# EAGLE schematic BpodMainBoard_r0_8 (EAGLE 7.7.0)
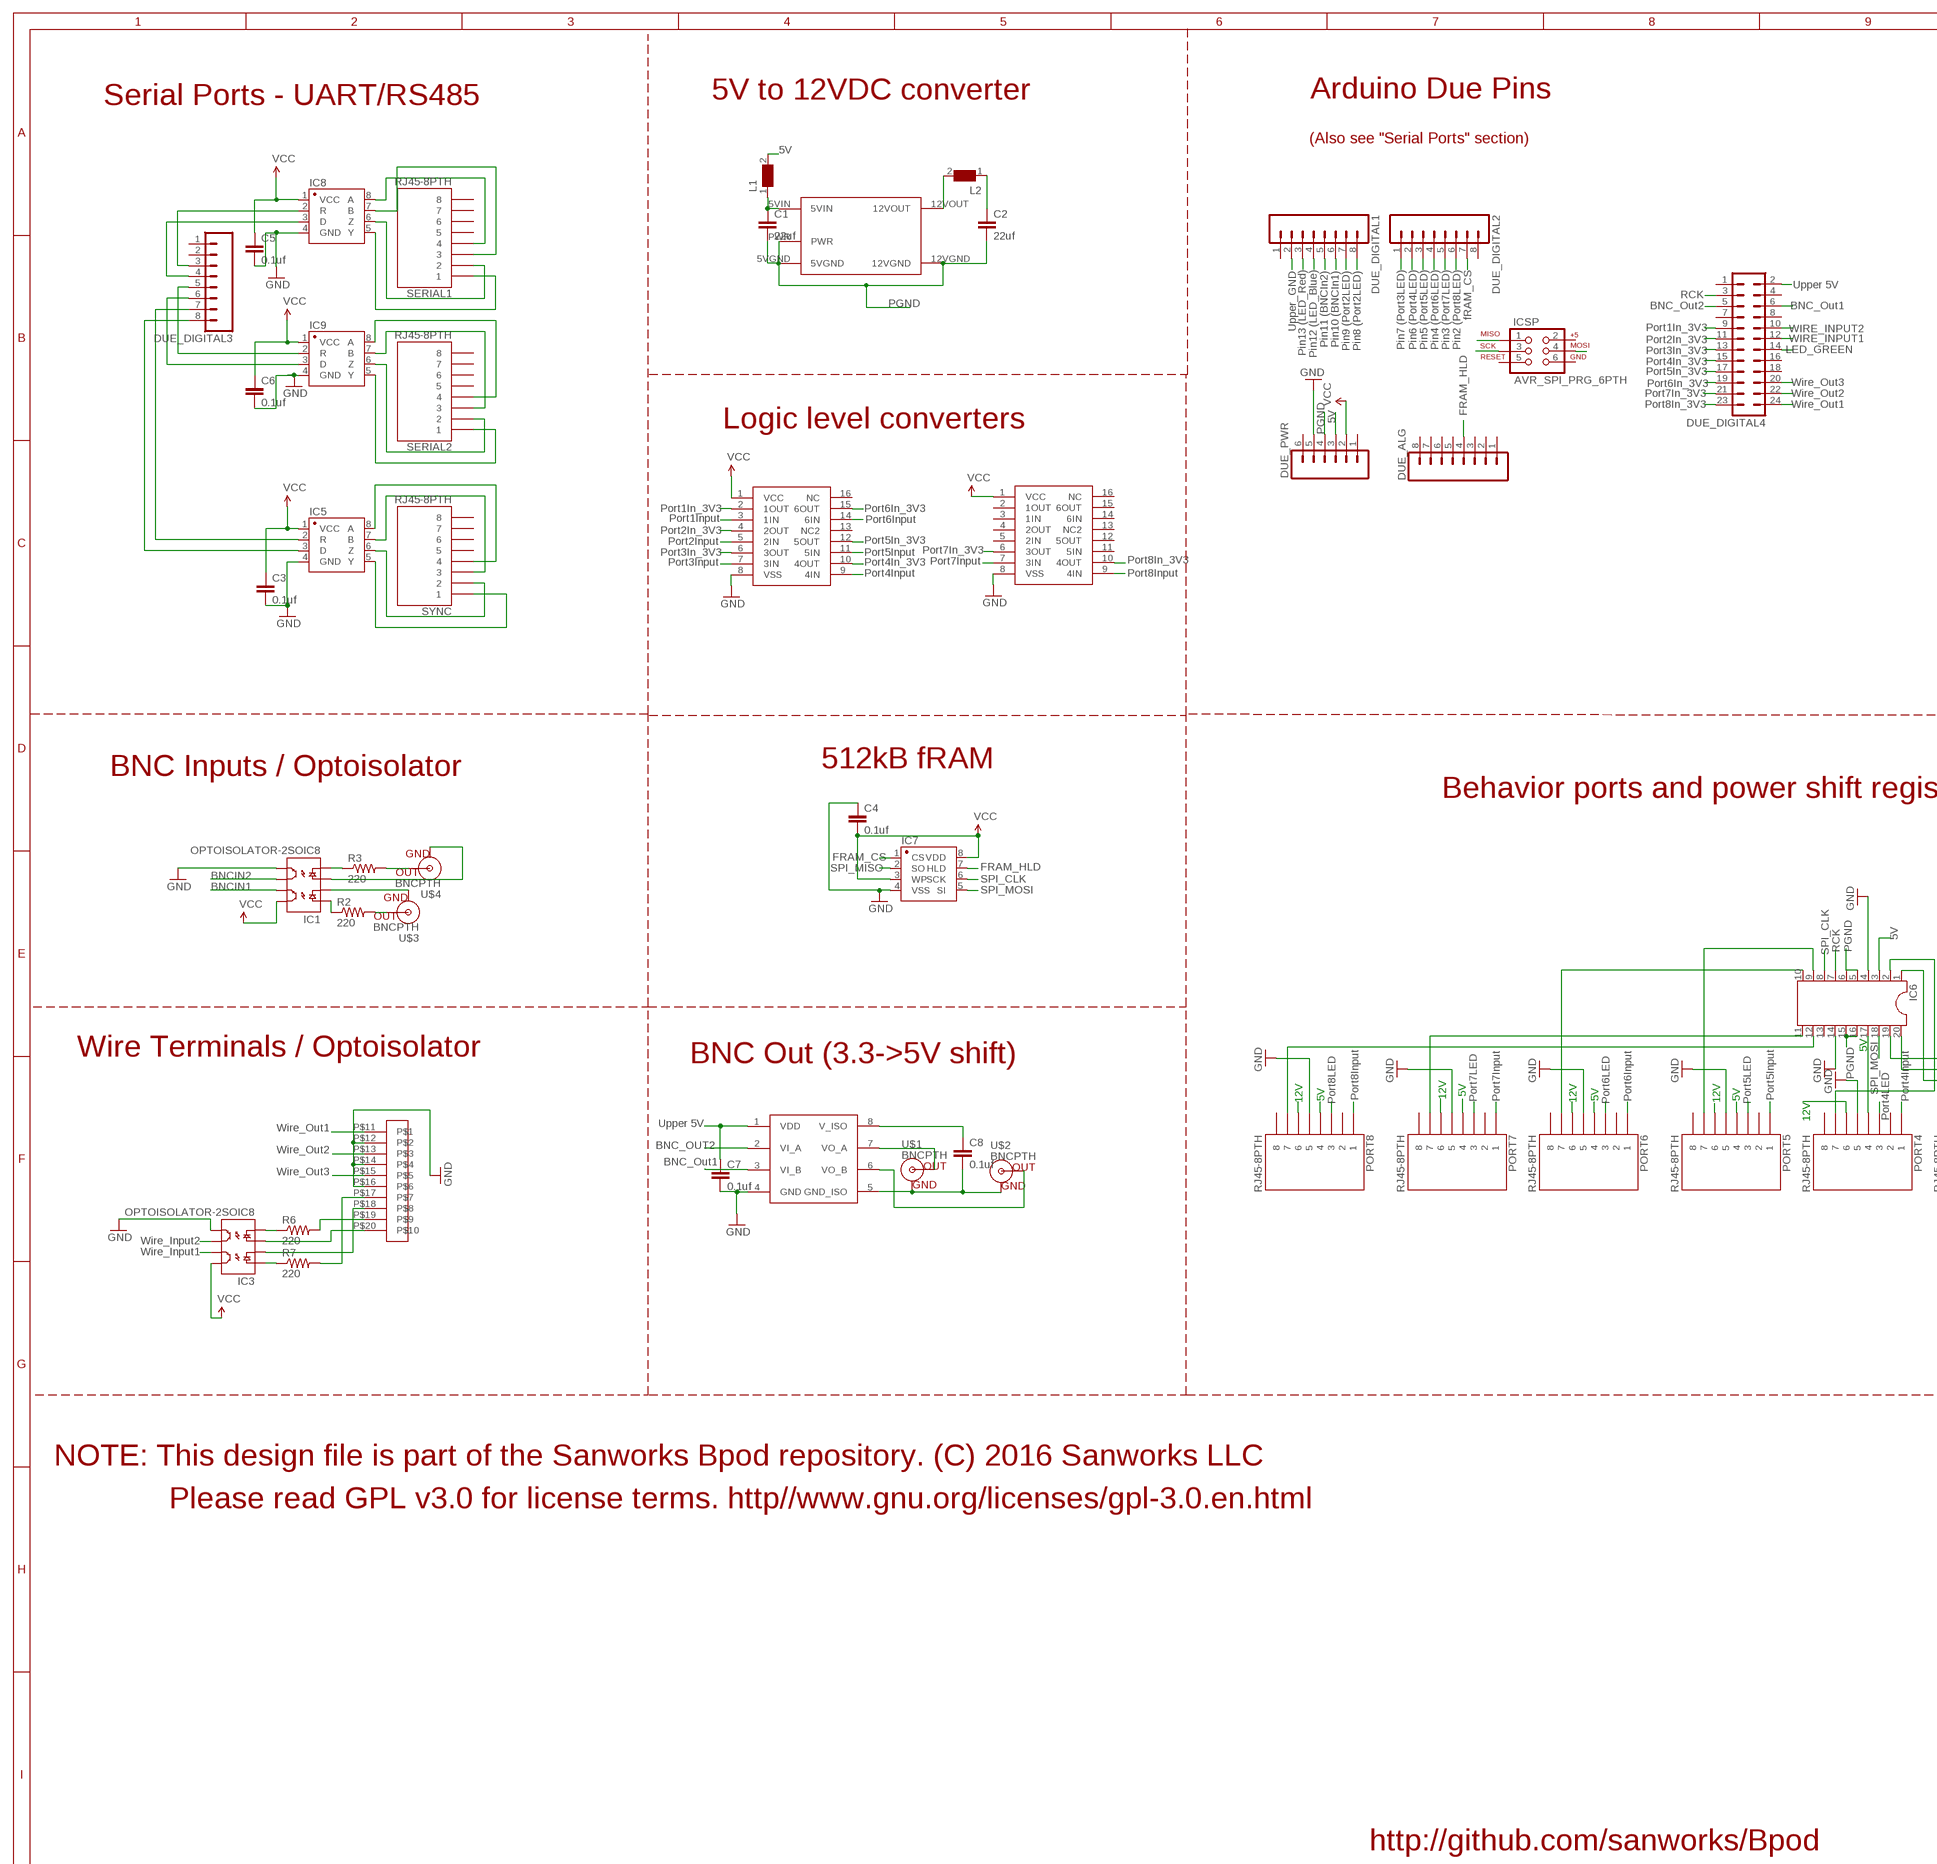
[diagram p0: schematic, sheet 1, part 1 of 2]
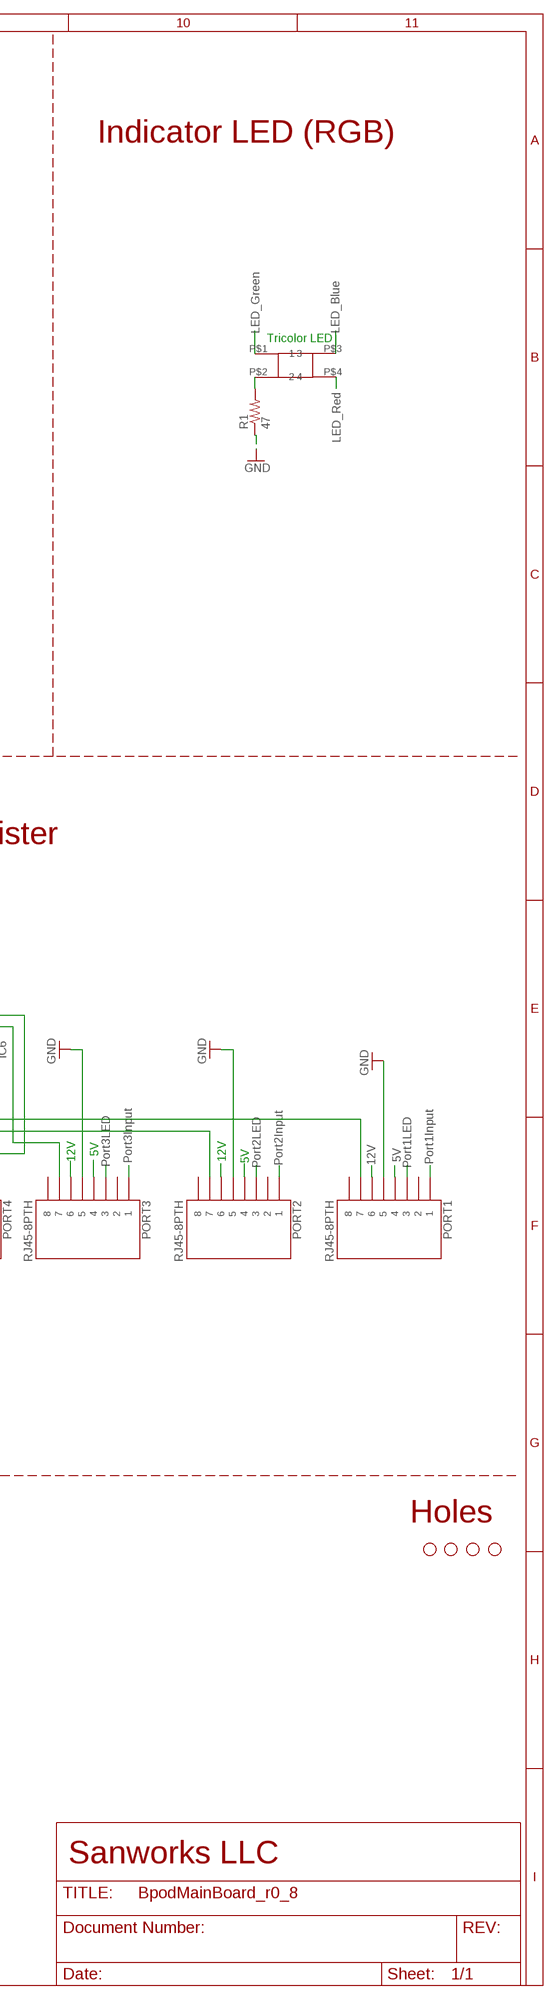
[diagram p1: schematic, sheet 1, part 2 of 2]

## Parts
C1  22uf  CAP1206  [1206]
C2  22uf  CAP1206  [1206]
C3  0.1uf  CAP1206  [1206]
C4  0.1uf  CAP1206  [1206]
C5  0.1uf  CAP1206  [1206]
C6  0.1uf  CAP1206  [1206]
C7  0.1uf  CAP1206  [1206]
C8  0.1uf  CAP1206  [1206]
DUE_ALG  M081X08  [1X08]
DUE_DIGITAL1  M081X08  [1X08]
DUE_DIGITAL2  M081X08  [1X08]
DUE_DIGITAL3  M081X08  [1X08]
DUE_DIGITAL4  MA12-2  [MA12-2]
DUE_PWR  M06SIP  [1X06]
IC1  OPTOISOLATOR-2SOIC8  [SO08-2]
IC2  CD4050  [SO16]
IC3  OPTOISOLATOR-2SOIC8  [SO08-2]
IC4  CD4050  [SO16]
IC5  SN65HVD31DR  [SO08]
IC6  DIL20  [DIL20]
IC7  CY15B104Q-SXI  [SO08-UNIVERSAL]
IC8  SN65HVD31DR  [SO08]
IC9  SN65HVD31DR  [SO08]
IC10  ADUM5240  [SO08]
ICSP  AVR_SPI_PRG_6PTH  [2X3]
JP1  STAND-OFF  [STAND-OFF]
JP2  STAND-OFF  [STAND-OFF]
JP3  STAND-OFF  [STAND-OFF]
JP4  STAND-OFF  [STAND-OFF]
L1  WE-CBF-742792118_1206  [1206]
L2  WE-CBF-742792118_1206  [1206]
PORT1  RJ45-8PTH  [RJ45-8]
PORT2  RJ45-8PTH  [RJ45-8]
PORT3  RJ45-8PTH  [RJ45-8]
PORT4  RJ45-8PTH  [RJ45-8]
PORT5  RJ45-8PTH  [RJ45-8]
PORT6  RJ45-8PTH  [RJ45-8]
PORT7  RJ45-8PTH  [RJ45-8]
PORT8  RJ45-8PTH  [RJ45-8]
R1  47  RESISTOR1206  [1206]
R2  220  RESISTOR1206  [1206]
R3  220  RESISTOR1206  [1206]
R6  220  RESISTOR1206  [1206]
R7  220  RESISTOR1206  [1206]
SERIAL1  RJ45-8PTH  [RJ45-8]
SERIAL2  RJ45-8PTH  [RJ45-8]
SYNC  RJ45-8PTH  [RJ45-8]
U$1  BNCPTH  [BNC]
U$2  BNCPTH  [BNC]
U$3  BNCPTH  [BNC]
U$4  BNCPTH  [BNC]
U$5  TDK_LAMBDA_5V_TO_12V  [TDK_LAMBDA_5V_12V]
U$6  10POS_SPRING_TERMINAL  [10POS_SCREW_TERMINAL]
U$8  SQUARE_TRICOLOR_LED  [SQUARE_TRICOLOR_LED]

## Nets
5V: DUE_PWR.3 IC6.3 IC6.17 L1.2 PORT1.4 PORT2.4 PORT3.4 PORT4.4 PORT5.4 PORT6.4 PORT7.4 PORT8.4
12V: C2.1 L2.1 PORT1.6 PORT2.6 PORT3.6 PORT4.6 PORT5.6 PORT6.6 PORT7.6 PORT8.6
BNC_OUT1: DUE_DIGITAL4.6 IC10.3(VI_B)
BNC_OUT2: DUE_DIGITAL4.5 IC10.2(VI_A)
BNCIN1: DUE_DIGITAL1.6 IC1.7(EM1)
BNCIN2: DUE_DIGITAL1.5 IC1.6(CL2)
FRAM_CS: DUE_DIGITAL2.7 IC7.1(CS)
FRAM_HLD: DUE_ALG.4 IC7.7(HLD)
GND: C3.2 C5.2 C6.2 C7.2 DUE_PWR.5 IC1.5(EM2) IC2.8(VSS) IC3.5(EM2) IC4.8(VSS) IC5.4(GND) IC6.4 IC6.14 IC7.4(VSS) IC8.4(GND) IC9.4(GND) IC10.4(GND) PORT1.5 PORT2.5 PORT3.5 PORT4.5 PORT5.5 PORT6.5 PORT7.5 PORT8.5 R1.1 U$6.P$12 U$6.P$14 U$6.P$16
ISOGND: C8.2 IC10.5(GND_ISO) U$1.GND U$2.GND
LED_BLUE: DUE_DIGITAL1.4 U$8.P$3
LED_GREEN: DUE_DIGITAL4.14 U$8.P$1
LED_RED: DUE_DIGITAL1.3 U$8.P$4
MOSI: IC6.18 IC7.5(SI) ICSP.4
N$1: R3.2 U$4.S(OUT)
N$2: R2.2 U$3.S(OUT)
N$3: IC1.3(A2) U$4.GND
N$4: IC1.2(C1) U$3.GND
N$5: R6.2 U$6.P$19
N$6: IC10.6(VO_B) U$2.S(OUT)
N$8: IC10.7(VO_A) U$1.S(OUT)
N$9: IC6.19 PORT1.7
N$10: IC6.20 PORT2.7
N$11: IC6.1 PORT3.7
N$12: IC6.2 PORT4.7
N$13: IC6.9 PORT5.7
N$14: IC6.10 PORT6.7
N$15: IC6.11 PORT7.7
N$16: IC6.12 PORT8.7
N$17: IC5.8(A) SYNC.4
N$18: IC5.7(B) SYNC.3
N$19: IC5.6(Z) SYNC.2
N$21: IC5.5(Y) SYNC.1
N$22: DUE_DIGITAL3.7 IC5.2(R)
N$23: IC3.4(C2) R6.1
N$24: IC3.1(A1) R7.1
N$25: R1.2 U$8.P$2
N$26: C8.1 IC10.8(V_ISO)
N$28: DUE_DIGITAL3.8 IC5.3(D)
N$32: IC8.8(A) SERIAL1.4
N$33: IC8.7(B) SERIAL1.3
N$34: IC8.6(Z) SERIAL1.2
N$35: IC8.5(Y) SERIAL1.1
N$36: IC9.8(A) SERIAL2.4
N$37: IC9.7(B) SERIAL2.3
N$38: IC9.6(Z) SERIAL2.2
N$40: IC9.5(Y) SERIAL2.1
N$42: DUE_DIGITAL3.3 IC8.2(R)
N$43: IC3.3(A2) U$6.P$20
N$44: R7.2 U$6.P$17
N$45: IC3.2(C1) U$6.P$18
N$46: C1.1 L1.1 U$5.5VIN
N$47: L2.2 U$5.12VOUT
N$48: DUE_DIGITAL3.4 IC8.3(D)
N$52: DUE_DIGITAL3.5 IC9.2(R)
N$53: DUE_DIGITAL3.6 IC9.3(D)
N$54: IC1.1(A1) R2.1
N$55: IC1.4(C2) R3.1
PGND: C1.2 C2.2 DUE_PWR.4 IC6.5 IC6.6 IC6.15 IC6.16 U$5.5VGND U$5.12VGND U$5.PWR
PORT1IN_3V3: DUE_DIGITAL4.9 IC4.2(1OUT)
PORT1INPUT: IC4.3(1IN) PORT1.1
PORT1LED: DUE_DIGITAL1.7 PORT1.3
PORT2IN_3V3: DUE_DIGITAL4.11 IC4.4(2OUT)
PORT2INPUT: IC4.5(2IN) PORT2.1
PORT2LED: DUE_DIGITAL1.8 PORT2.3
PORT3IN_3V3: DUE_DIGITAL4.13 IC4.6(3OUT)
PORT3INPUT: IC4.7(3IN) PORT3.1
PORT3LED: DUE_DIGITAL2.1 PORT3.3
PORT4IN_3V3: DUE_DIGITAL4.15 IC4.10(4OUT)
PORT4INPUT: IC4.9(4IN) PORT4.1
PORT4LED: DUE_DIGITAL2.2 PORT4.3
PORT5IN_3V3: DUE_DIGITAL4.17 IC4.12(5OUT)
PORT5INPUT: IC4.11(5IN) PORT5.1
PORT5LED: DUE_DIGITAL2.3 PORT5.3
PORT6IN_3V3: DUE_DIGITAL4.19 IC4.15(6OUT)
PORT6INPUT: IC4.14(6IN) PORT6.1
PORT6LED: DUE_DIGITAL2.4 PORT6.3
PORT7IN_3V3: DUE_DIGITAL4.21 IC2.6(3OUT)
PORT7INPUT: IC2.7(3IN) PORT7.1
PORT7LED: DUE_DIGITAL2.5 PORT7.3
PORT8IN_3V3: DUE_DIGITAL4.23 IC2.10(4OUT)
PORT8INPUT: IC2.9(4IN) PORT8.1
PORT8LED: DUE_DIGITAL2.6 PORT8.3
RCK: DUE_DIGITAL4.3 IC6.7
SPI_CLK: IC6.8 IC7.6(SCK) ICSP.3
SPI_MISO: IC7.2(SO) ICSP.1
UPPER_5V: C7.1 DUE_DIGITAL4.2 IC10.1(VDD)
UPPER_GND: DUE_DIGITAL1.2
VCC: C3.1 C4.2 C5.1 C6.1 DUE_PWR.2 IC1.8(CL1) IC2.1(VCC) IC3.8(CL1) IC4.1(VCC) IC5.1(VCC) IC7.3(WP) IC7.8(VDD) IC8.1(VCC) IC9.1(VCC)
WIRE_INPUT1: DUE_DIGITAL4.12 IC3.7(EM1)
WIRE_INPUT2: DUE_DIGITAL4.10 IC3.6(CL2)
WIRE_OUT1: DUE_DIGITAL4.24 U$6.P$11
WIRE_OUT2: DUE_DIGITAL4.22 U$6.P$13
WIREOUT3: DUE_DIGITAL4.20 U$6.P$15
Unconnected: C4.1 DUE_ALG.1 DUE_ALG.2 DUE_ALG.3 DUE_ALG.5 DUE_ALG.6 DUE_ALG.7 DUE_ALG.8 DUE_DIGITAL1.1 DUE_DIGITAL2.8 DUE_DIGITAL3.1 DUE_DIGITAL3.2 DUE_DIGITAL4.1 DUE_DIGITAL4.4 DUE_DIGITAL4.7 DUE_DIGITAL4.8 DUE_DIGITAL4.16 DUE_DIGITAL4.18 DUE_PWR.1 DUE_PWR.6 IC2.2(1OUT) IC2.3(1IN) IC2.4(2OUT) IC2.5(2IN) IC2.11(5IN) IC2.12(5OUT) IC2.13(NC2) IC2.14(6IN) IC2.15(6OUT) IC2.16(NC) IC4.13(NC2) IC4.16(NC) IC6.13 ICSP.2 ICSP.5 ICSP.6 PORT1.2 PORT1.8 PORT2.2 PORT2.8 PORT3.2 PORT3.8 PORT4.2 PORT4.8 PORT5.2 PORT5.8 PORT6.2 PORT6.8 PORT7.2 PORT7.8 PORT8.2 PORT8.8 SERIAL1.5 SERIAL1.6 SERIAL1.7 SERIAL1.8 SERIAL2.5 SERIAL2.6 SERIAL2.7 SERIAL2.8 SYNC.5 SYNC.6 SYNC.7 SYNC.8

## Notes on the sheet
- Serial Ports - UART/RS485 | 5V to 12VDC converter | Arduino Due Pins
- Indicator LED (RGB)
- (Also see "Serial Ports" section)
- 5V
- LED_Green
- LED_Blue
- Upper_GND | Pin13 (LED_Red) | Pin12 (LED_Blue) | Pin11 (BNCIn2) | Pin10 (BNCIn1) | Pin9 (Port2LED) | Pin8 (Port2LED) | Pin7 (Port3LED) | Pin6 (Port4LED) | Pin5 (Port5LED) | Pin4 (Port6LED) | Pin3 (Port7LED) | Pin2 (Port8LED) | fRAM_CS
- Upper 5V
- RCK
- BNC_Out2 | BNC_Out1
- PGND
- WIRE_INPUT2 | Tricolor LED
- Port1In_3V3
- WIRE_INPUT1
- Port2In_3V3 | LED_GREEN
- Port3In_3V3
- Port4In_3V3
- LED_Red
- Port5In_3V3
- Wire_Out3
- Port6In_3V3 | Wire_Out2
- Port7In_3V3
- Wire_Out1
- Port8In_3V3
- FRAM_HLD
- 5V
- Logic level converters
- PGND
- Port1In_3V3 | Port6In_3V3
- Port1Input | Port6Input
- Port2In_3V3
- Port2Input | Port5In_3V3
- Port3In_3V3 | Port5Input | Port7In_3V3
- Port3Input | Port4In_3V3 | Port7Input | Port8In_3V3
- Port4Input | Port8Input
- BNC Inputs / Optoisolator | 512kB fRAM
- Behavior ports and power shift register
- FRAM_CS
- SPI_MISO | FRAM_HLD
- BNCIN2
- SPI_CLK
- BNCIN1
- SPI_MOSI
- SPI_CLK
- PGND
- RCK | 5V
- 5V
- SPI_MOSI
- Port8Input | Port5Input | PGND | Port3Input | Port2Input | Port1Input
- Port7Input | Port6Input | Port4Input
- Port8LED | Port7LED | Port6LED | Port5LED | Port3LED | Port2LED | Port1LED
- Wire Terminals / Optoisolator | BNC Out (3.3->5V shift)
- Port4LED
- 12V | 12V | 5V | 12V
- 12V | 5V | 12V | 12V | 12V
- 5V | 5V | 5V | 5V | 5V
- 12V
- Upper 5V
- Wire_Out1
- BNC_OUT2
- Wire_Out2
- BNC_Out1
- Wire_Out3
- Wire_Input2
- Wire_Input1
- Holes
- NOTE: This design file is part of the Sanworks Bpod repository. (C) 2016 Sanworks LLC
- Please read GPL v3.0 for license terms. http//www.gnu.org/licenses/gpl-3.0.en.html
- Sanworks LLC
- http://github.com/sanworks/Bpod

## Library data of the parts
C1-C8 = SparkFun-Capacitors:CAP: Capacitor Standard 0603 ceramic capacitor, and 0.1" leaded capacitor.
DUE_ALG DUE_DIGITAL1-DUE_DIGITAL3 = SparkFun:M08: Header 8 Standard 8-pin 0.1" header. Use with straight break away headers (SKU : PRT-00116), right angle break away headers (PRT-00553), swiss pins (PRT-00743), machine pins (PRT-00117), and female headers (PRT-00115).
DUE_DIGITAL4 = con-lstb:MA12-2: PIN HEADER; OC_FARNELL: unknown; OC_NEWARK: unknown
DUE_PWR = SparkFun:M06: Header 6 Standard 6-pin 0.1" header. Use with straight break away headers (SKU : PRT-00116), right angle break away headers (PRT-00553), swiss pins (PRT-00743), machine pins (PRT-00117), and female headers (PRT-00115). Molex polarized connector foot print use with SKU : PRT-08094 with associated crimp pins and housings. NOTES ON THE VARIANTS LOCK and LOCK_LONGPADS... This footprint was designed to help hold the alignment of a through-hole component (i.e. 6-pin header) while soldering it into place. You may notice that each hole has been shifted either up or down by 0.005 of an inch from it's more standard position (which is a perfectly straight line). This slight alteration caused the pins (the squares in the middle) to touch the edges of the holes. Because they are alternating, it causes a "brace" to hold the component in place. 0.005 has proven to be the perfect amount of "off-center" position when using our standard breakaway headers. Although looks a little odd when you look at the bare footprint, once you have a header in there, the alteration is very hard to notice. Also, if you push a header all the way into place, it is covered up entirely on the bottom side. This idea of altering the position of holes to aid alignment will be further integrated into the Sparkfun Library for other footprints. It can help hold any component with 3 or more connection pins.
IC1 IC3 = SparkFun-DiscreteSemi:OPTOISOLATOR-2: Description: Dual gate opto isolator. Vishay part : ILD213T; PROD_ID: IC-09076
IC2 IC4 = SparkFun-DigitalIC:CD4050
IC5 IC8 IC9 = Joshparts4:SN65HVD31DR: A placeholder for generic narrow & wide SOIC8 foorptints - used on the DIP adapter board.
IC6 = ic-package:DIL20: Dual In Line / Socket
IC7 = Joshparts4:CY15B104Q-SXI: A placeholder for generic narrow & wide SOIC8 foorptints - used on the DIP adapter board.
IC10 = SparkFun-DigitalIC:ADUM5240
ICSP = SparkFun:AVR_SPI_PRG_6: AVR ISP 6 Pin This is the reduced ISP connector for AVR programming. Common on Arduino. This footprint will take up less PCB space and can be used with a 10-pin to 6-pin adapter such as SKU: BOB-08508
JP1-JP4 = SparkFun:STAND-OFF: Stand Off This is the mechanical footprint for a #4 phillips button head screw. Use the keepout ring to avoid running the screw head into surrounding components. SKU : PRT-00447
L1 L2 = WE-CBF:WE-CBF: SMD EMI Suppression Ferrite Beads WE-CBF - Excellent anti-EMI properties - Low DC-restistance - Impedances till 3000 ohms - Rated current up to 6 A -- Reliable Ni-Sn electrodes -- Perfect as data lined filter and for uncoupling of distribution voltage; MPN: 742792118; OC_FARNELL: 1800374; OC_NEWARK: 78R5648; PACKAGE: IND-1206; SUPPLIER: Wuerth Elektronik
PORT1-PORT8 SERIAL1 SERIAL2 SYNC = SparkFun:RJ45-8: RJ45 Jack Simple RJ45, 8-pin connection - connector for common Cat5, Cat5e, and Cat6 Ethernet cables. Footprint not yet proven in production. Connector sku is PRT-00643; Breakout PCB sku is BOB-00716.
R1 = SparkFun-Passives:RESISTOR: Resistor Basic schematic elements and footprints for 0603, 1206, and PTH resistors.
R2 R3 R6 R7 = SparkFun-Resistors:RESISTOR: Resistor Basic schematic elements and footprints for 0603, 1206, and PTH resistors.
U$1 U$2 = SparkFun-Connectors:BNC: BNC Connector, Mouser Part# 5227161
U$3 U$4 = SparkFun:BNC: BNC Connector, Mouser Part# 5227161
U$5 = JoshParts:TDK_LAMBDA_5V_TO_12V
U$6 = JoshParts:10POS_SPRING_TERMINAL
U$8 = JoshParts:SQUARE_TRICOLOR_LED

## Net classes
0 default: width 0.254 mm, clearance 0.254 mm